# EAGLE schematic ProbeStationRelayBoard (EAGLE 9.6.2)
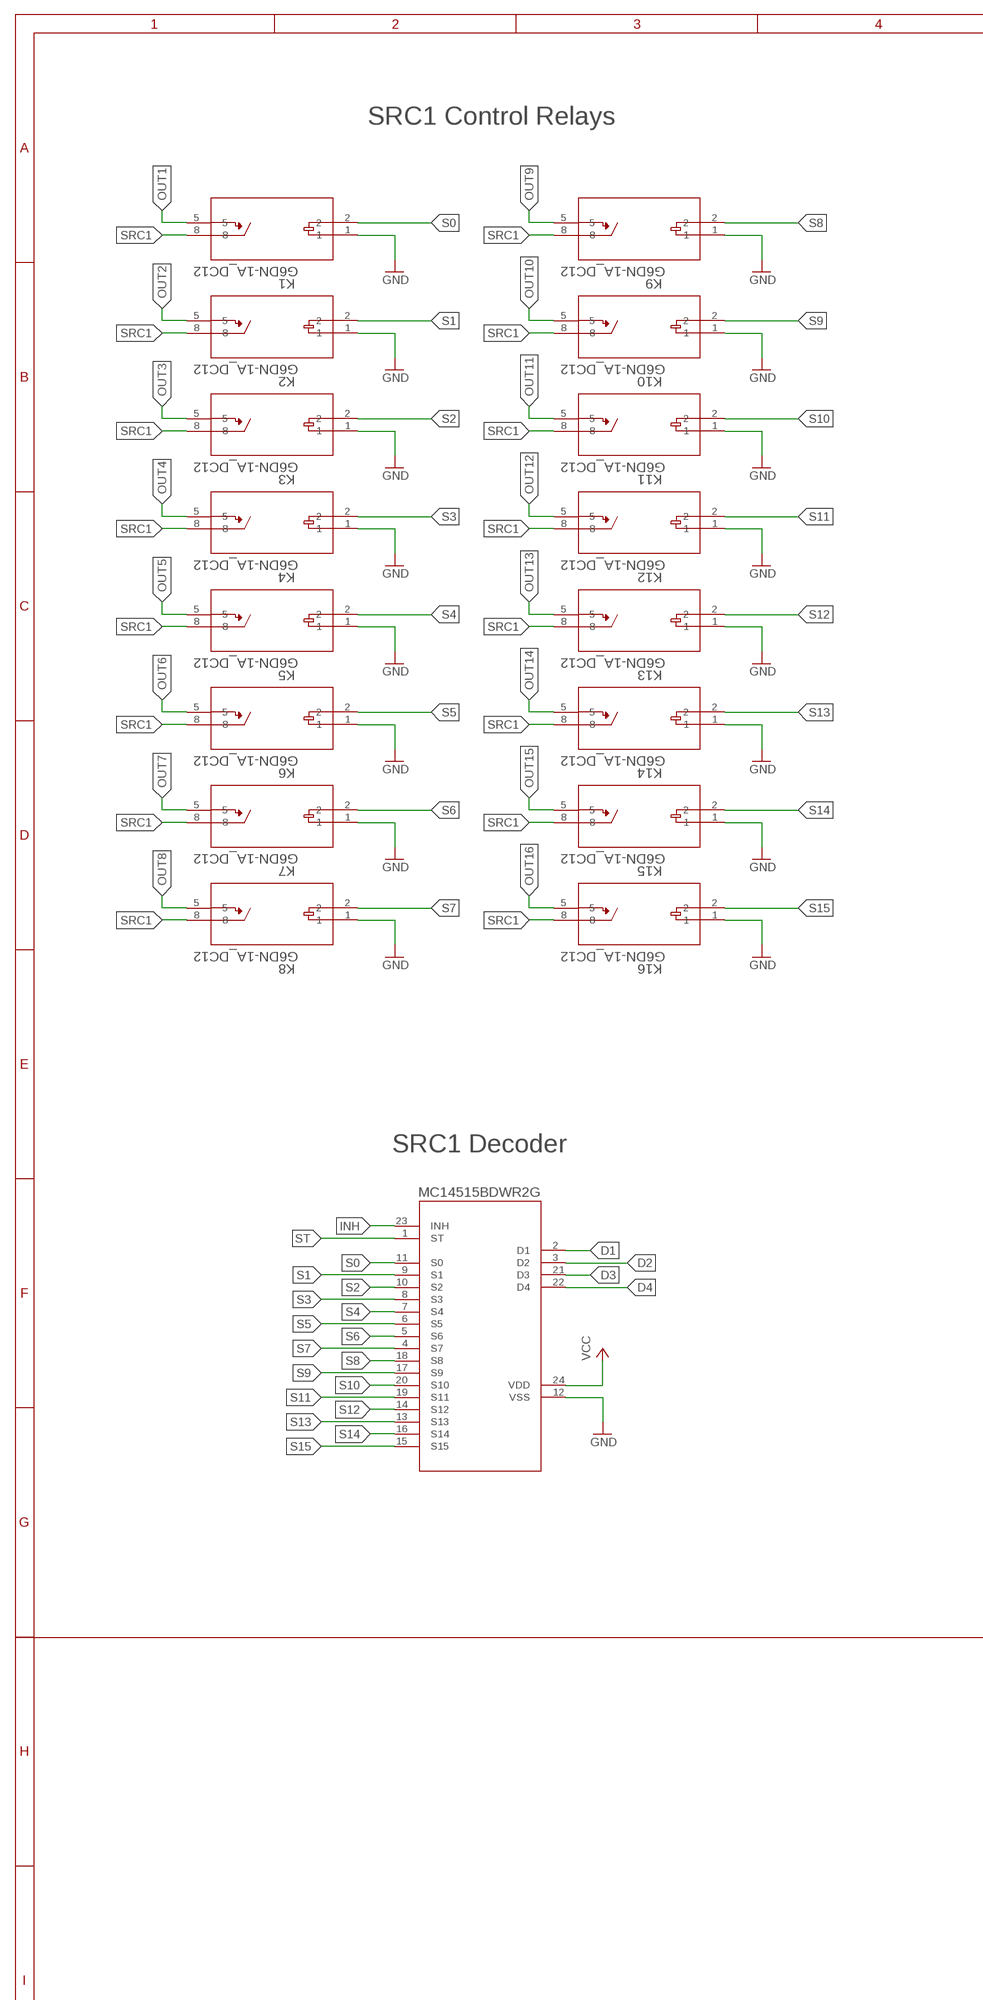
[diagram p0: schematic, sheet 1, part 1 of 2]
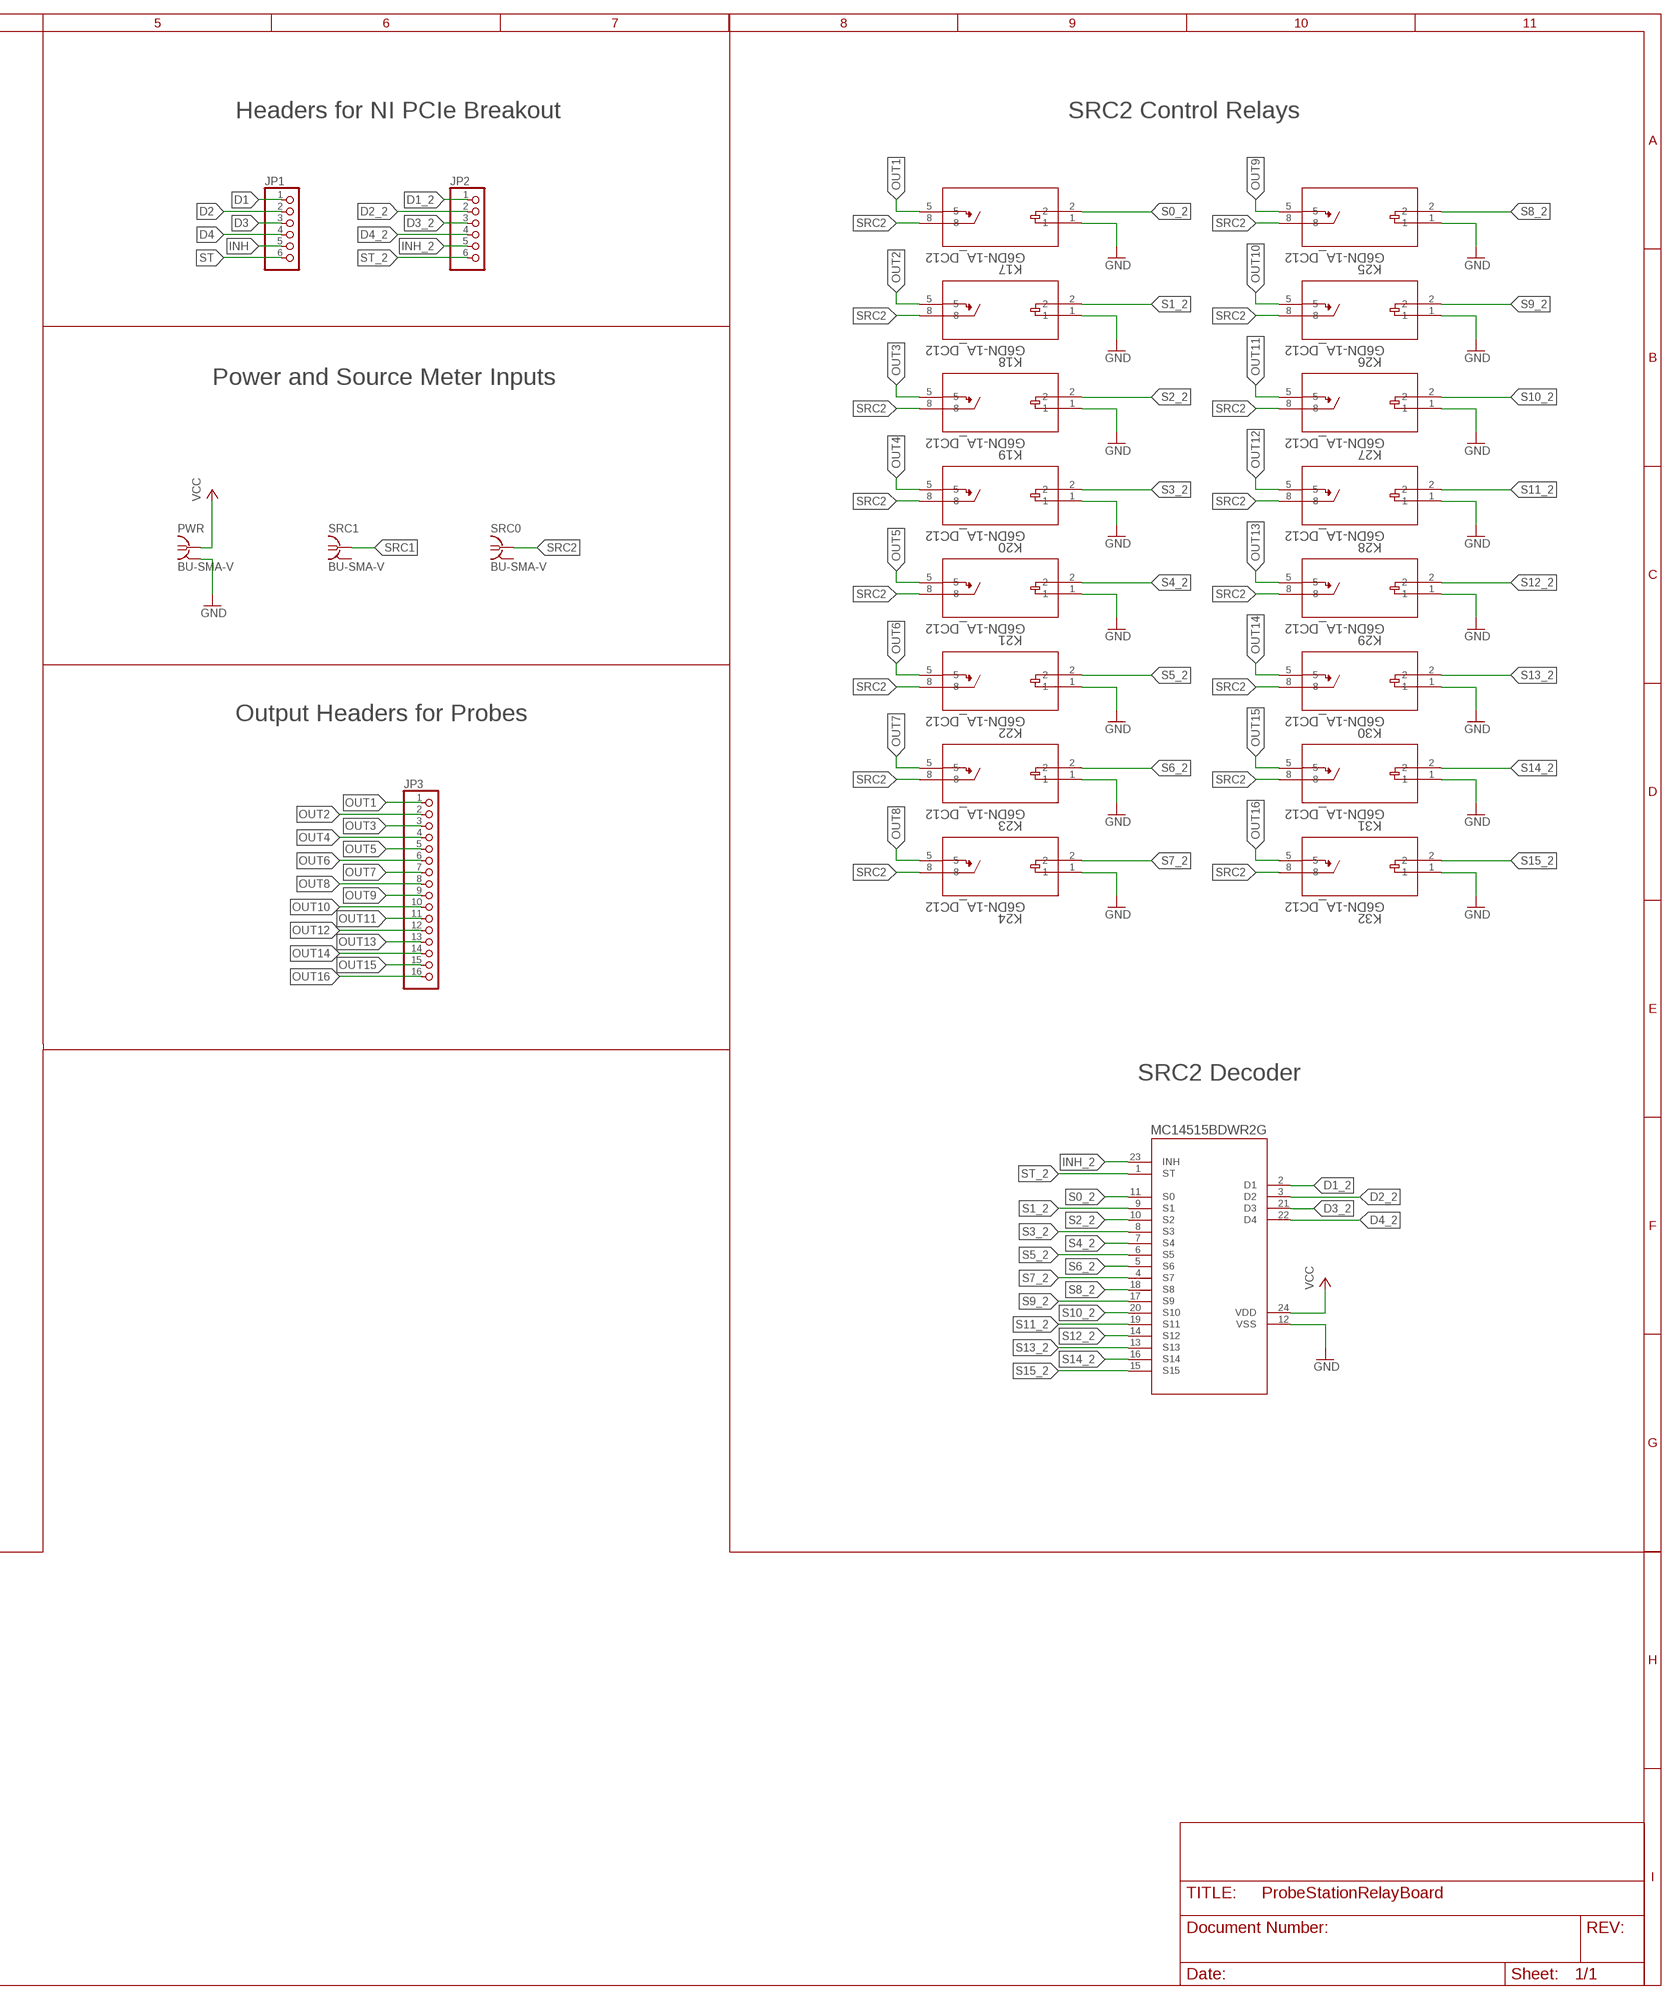
[diagram p1: schematic, sheet 1, part 2 of 2]

## Parts
JP1  PINHD-1X6  [1X06]
JP2  PINHD-1X6  [1X06]
JP3  PINHD-1X16  [1X16]
K1  G6DN-1A_DC12  [RELAY_G6DN-1A_OMR]
K2  G6DN-1A_DC12  [RELAY_G6DN-1A_OMR]
K3  G6DN-1A_DC12  [RELAY_G6DN-1A_OMR]
K4  G6DN-1A_DC12  [RELAY_G6DN-1A_OMR]
K5  G6DN-1A_DC12  [RELAY_G6DN-1A_OMR]
K6  G6DN-1A_DC12  [RELAY_G6DN-1A_OMR]
K7  G6DN-1A_DC12  [RELAY_G6DN-1A_OMR]
K8  G6DN-1A_DC12  [RELAY_G6DN-1A_OMR]
K9  G6DN-1A_DC12  [RELAY_G6DN-1A_OMR]
K10  G6DN-1A_DC12  [RELAY_G6DN-1A_OMR]
K11  G6DN-1A_DC12  [RELAY_G6DN-1A_OMR]
K12  G6DN-1A_DC12  [RELAY_G6DN-1A_OMR]
K13  G6DN-1A_DC12  [RELAY_G6DN-1A_OMR]
K14  G6DN-1A_DC12  [RELAY_G6DN-1A_OMR]
K15  G6DN-1A_DC12  [RELAY_G6DN-1A_OMR]
K16  G6DN-1A_DC12  [RELAY_G6DN-1A_OMR]
K17  G6DN-1A_DC12  [RELAY_G6DN-1A_OMR]
K18  G6DN-1A_DC12  [RELAY_G6DN-1A_OMR]
K19  G6DN-1A_DC12  [RELAY_G6DN-1A_OMR]
K20  G6DN-1A_DC12  [RELAY_G6DN-1A_OMR]
K21  G6DN-1A_DC12  [RELAY_G6DN-1A_OMR]
K22  G6DN-1A_DC12  [RELAY_G6DN-1A_OMR]
K23  G6DN-1A_DC12  [RELAY_G6DN-1A_OMR]
K24  G6DN-1A_DC12  [RELAY_G6DN-1A_OMR]
K25  G6DN-1A_DC12  [RELAY_G6DN-1A_OMR]
K26  G6DN-1A_DC12  [RELAY_G6DN-1A_OMR]
K27  G6DN-1A_DC12  [RELAY_G6DN-1A_OMR]
K28  G6DN-1A_DC12  [RELAY_G6DN-1A_OMR]
K29  G6DN-1A_DC12  [RELAY_G6DN-1A_OMR]
K30  G6DN-1A_DC12  [RELAY_G6DN-1A_OMR]
K31  G6DN-1A_DC12  [RELAY_G6DN-1A_OMR]
K32  G6DN-1A_DC12  [RELAY_G6DN-1A_OMR]
PWR  BU-SMA-V  [BU-SMA-V]
SRC0  BU-SMA-V  [BU-SMA-V]
SRC1  BU-SMA-V  [BU-SMA-V]
U1  MC14515BDWR2G  [SOIC-24WB_ONS]
U2  MC14515BDWR2G  [SOIC-24WB_ONS]

## Nets
D1: JP1.1 U2.2(D1)
D1_2: JP2.1 U1.2(D1)
D2: JP1.2 U2.3(D2)
D2_2: JP2.2 U1.3(D2)
D3: JP1.3 U2.21(D3)
D3_2: JP2.3 U1.21(D3)
D4: JP1.4 U2.22(D4)
D4_2: JP2.4 U1.22(D4)
GND: K1.1 K2.1 K3.1 K4.1 K5.1 K6.1 K7.1 K8.1 K9.1 K10.1 K11.1 K12.1 K13.1 K14.1 K15.1 K16.1 K17.1 K18.1 K19.1 K20.1 K21.1 K22.1 K23.1 K24.1 K25.1 K26.1 K27.1 K28.1 K29.1 K30.1 K31.1 K32.1 PWR.2 PWR.3 PWR.4 PWR.5 U1.12(VSS) U2.12(VSS)
INH: JP1.5 U2.23(INH)
INH_2: JP2.5 U1.23(INH)
OUT1: JP3.1 K1.5 K17.5
OUT2: JP3.2 K2.5 K18.5
OUT3: JP3.3 K3.5 K19.5
OUT4: JP3.4 K4.5 K20.5
OUT5: JP3.5 K5.5 K21.5
OUT6: JP3.6 K6.5 K22.5
OUT7: JP3.7 K7.5 K23.5
OUT8: JP3.8 K8.5 K24.5
OUT9: JP3.9 K9.5 K25.5
OUT10: JP3.10 K10.5 K26.5
OUT11: JP3.11 K11.5 K27.5
OUT12: JP3.12 K12.5 K28.5
OUT13: JP3.13 K13.5 K29.5
OUT14: JP3.14 K14.5 K30.5
OUT15: JP3.15 K15.5 K31.5
OUT16: JP3.16 K16.5 K32.5
S0: K1.2 U2.11(S0)
S0_2: K17.2 U1.11(S0)
S1: K2.2 U2.9(S1)
S1_2: K18.2 U1.9(S1)
S2: K3.2 U2.10(S2)
S2_2: K19.2 U1.10(S2)
S3: K4.2 U2.8(S3)
S3_2: K20.2 U1.8(S3)
S4: K5.2 U2.7(S4)
S4_2: K21.2 U1.7(S4)
S5: K6.2 U2.6(S5)
S5_2: K22.2 U1.6(S5)
S6: K7.2 U2.5(S6)
S6_2: K23.2 U1.5(S6)
S7: K8.2 U2.4(S7)
S7_2: K24.2 U1.4(S7)
S8: K9.2 U2.18(S8)
S8_2: K25.2 U1.18(S8)
S9: K10.2 U2.17(S9)
S9_2: K26.2 U1.17(S9)
S10: K11.2 U2.20(S10)
S10_2: K27.2 U1.20(S10)
S11: K12.2 U2.19(S11)
S11_2: K28.2 U1.19(S11)
S12: K13.2 U2.14(S12)
S12_2: K29.2 U1.14(S12)
S13: K14.2 U2.13(S13)
S13_2: K30.2 U1.13(S13)
S14: K15.2 U2.16(S14)
S14_2: K31.2 U1.16(S14)
S15: K16.2 U2.15(S15)
S15_2: K32.2 U1.15(S15)
SRC1: K1.8 K2.8 K3.8 K4.8 K5.8 K6.8 K7.8 K8.8 K9.8 K10.8 K11.8 K12.8 K13.8 K14.8 K15.8 K16.8 SRC1.1
SRC2: K17.8 K18.8 K19.8 K20.8 K21.8 K22.8 K23.8 K24.8 K25.8 K26.8 K27.8 K28.8 K29.8 K30.8 K31.8 K32.8 SRC0.1
ST: JP1.6 U2.1(ST)
ST_2: JP2.6 U1.1(ST)
VCC: PWR.1 U1.24(VDD) U2.24(VDD)
Unconnected: SRC0.2 SRC0.3 SRC0.4 SRC0.5 SRC1.2 SRC1.3 SRC1.4 SRC1.5

## Notes on the sheet
- SRC1 Control Relays | Headers for NI PCIe Breakout | SRC2 Control Relays
- Power and Source Meter Inputs
- Output Headers for Probes
- SRC2 Decoder
- SRC1 Decoder

## Library data of the parts
JP1 JP2 = pinhead:PINHD-1X6: PIN HEADER
JP3 = pinhead:PINHD-1X16: PIN HEADER
K1-K32 = RELAY_G6DN_DC12:G6DN-1A_DC12; COPYRIGHT: Copyright (C) 2021 Ultra Librarian. All rights reserved.; DIGI-KEY_PART_NUMBER_1: Z5440-ND; MANUFACTURER_PART_NUMBER: G6DN-1A DC12; MFR_NAME: Omron
PWR SRC0 SRC1 = con-coax:BU-SMA-V: FEMALE SMA CONNECTOR Radiall distributor RS 112-3794; OC_FARNELL: unknown; OC_NEWARK: unknown
U1 U2 = MC14515BDWR2G:MC14515BDWR2G; COPYRIGHT: Copyright (C) 2021 Ultra Librarian. All rights reserved.; DIGI-KEY_PART_NUMBER_1: 2156-MC14515BDWR2G-OS-ND; DIGI-KEY_PART_NUMBER_2: MC14515BDWR2G-ND; DIGI-KEY_PART_NUMBER_3: MC14515BDWR2GOSCT-ND; DIGI-KEY_PART_NUMBER_4: MC14515BDWR2GOSDKR-ND; DIGI-KEY_PART_NUMBER_5: MC14515BDWR2GOSTR-ND; MANUFACTURER_PART_NUMBER: MC14515BDWR2G; MFR_NAME: ON Semiconductor